# Altium schematic sheet LTC6803-3.SchDoc
size A4
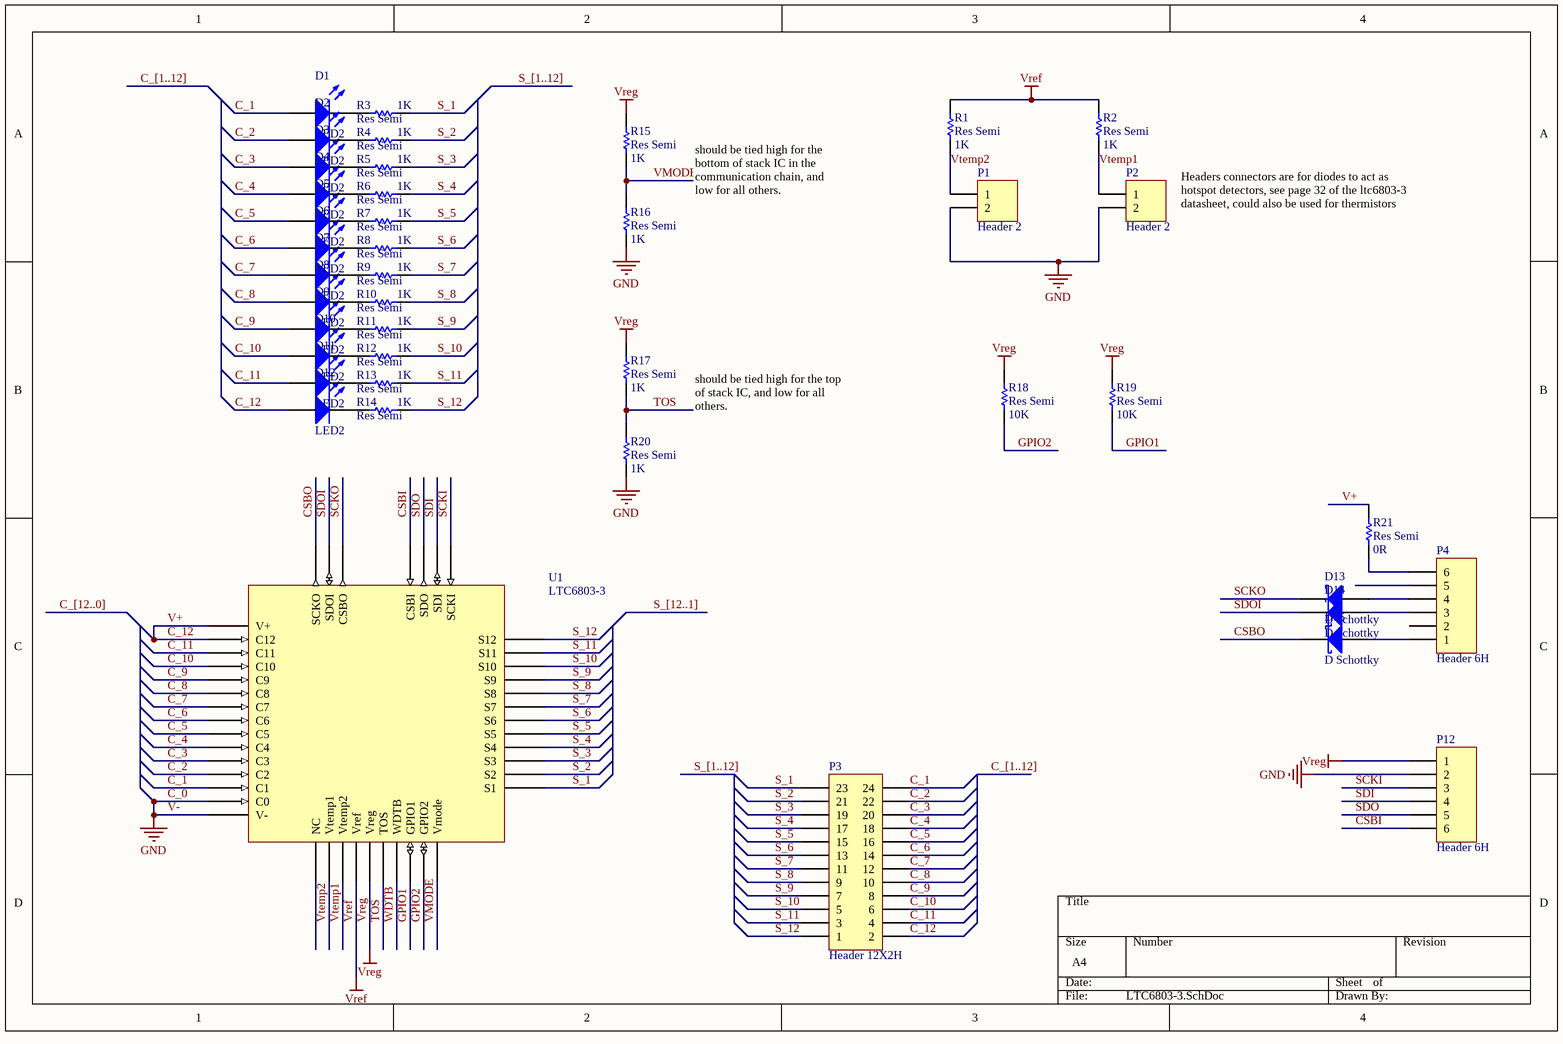
[diagram p0: LTC6803-3.SchDoc]

## Parts
D1  LED2  [6-0805_N]
D2  LED2  [6-0805_N]
D3  LED2  [6-0805_N]
D4  LED2  [6-0805_N]
D5  LED2  [6-0805_N]
D6  LED2  [6-0805_N]
D7  LED2  [6-0805_N]
D8  LED2  [6-0805_N]
D9  LED2  [6-0805_N]
D10  LED2  [6-0805_N]
D11  LED2  [6-0805_N]
D12  LED2  [6-0805_N]
D13  D Schottky  [SMB]
D14  D Schottky  [SMB]
D15  D Schottky  [SMB]
P1  Header 2  [HDR1X2]
P2  Header 2  [HDR1X2]
P3  Header 12X2H  [HDR2X12H]
P4  Header 6H  [HDR1X6H]
P12  Header 6H  [HDR1X6H]
R1  Res Semi  value 1K  [6-0805_L]
R2  Res Semi  value 1K  [6-0805_L]
R3  Res Semi  value 1K  [6-0805_L]
R4  Res Semi  value 1K  [6-0805_L]
R5  Res Semi  value 1K  [6-0805_L]
R6  Res Semi  value 1K  [6-0805_L]
R7  Res Semi  value 1K  [6-0805_L]
R8  Res Semi  value 1K  [6-0805_L]
R9  Res Semi  value 1K  [6-0805_L]
R10  Res Semi  value 1K  [6-0805_L]
R11  Res Semi  value 1K  [6-0805_L]
R12  Res Semi  value 1K  [6-0805_L]
R13  Res Semi  value 1K  [6-0805_L]
R14  Res Semi  value 1K  [6-0805_L]
R15  Res Semi  value 1K  [6-0805_L]
R16  Res Semi  value 1K  [6-0805_L]
R17  Res Semi  value 1K  [6-0805_L]
R18  Res Semi  value 10K  [6-0805_L]
R19  Res Semi  value 10K  [6-0805_L]
R20  Res Semi  value 1K  [6-0805_L]
R21  Res Semi  value 0R  [6-0805_L]
U1  LTC6803-3  [SOP44]

## Nets
C_0: P1.2 P2.2 P12.2 R16.1 R20.1 U1.29(C0) U1.30(V-)  [also labelled GND, V-]
Vref: R1.2 R2.2 U1.34(Vref)
Vreg: P12.1 R15.2 R17.2 R18.2 R19.2 U1.35(Vreg)
C_1: D1.1(A) P3.24 U1.27(C1)
C_2: D2.1(A) P3.22 U1.25(C2)
C_3: D3.1(A) P3.20 U1.23(C3)
C_4: D4.1(A) P3.18 U1.21(C4)
C_5: D5.1(A) P3.16 U1.19(C5)
C_6: D6.1(A) P3.14 U1.17(C6)
C_7: D7.1(A) P3.12 U1.15(C7)
C_8: D8.1(A) P3.10 U1.13(C8)
C_9: D9.1(A) P3.8 U1.11(C9)
C_10: D10.1(A) P3.6 U1.9(C10)
C_11: D11.1(A) P3.4 U1.7(C11)
C_12: D12.1(A) P3.2 R21.2 U1.4(V+) U1.5(C12)  [also labelled V+]
CSBI: P12.6 U1.44(CSBI)
CSBO: D15.2(K) U1.3(SCKO)
GPIO1: R19.1 U1.38(GPIO1)
GPIO2: R18.1 U1.39(GPIO2)
S_1: P3.23 R3.2 U1.28(S1)
S_2: P3.21 R4.2 U1.26(S2)
S_3: P3.19 R5.2 U1.24(S3)
S_4: P3.17 R6.2 U1.22(S4)
S_5: P3.15 R7.2 U1.20(S5)
S_6: P3.13 R8.2 U1.18(S6)
S_7: P3.11 R9.2 U1.16(S7)
S_8: P3.9 R10.2 U1.14(S8)
S_9: P3.7 R11.2 U1.12(S9)
S_10: P3.5 R12.2 U1.10(S10)
S_11: P3.3 R13.2 U1.8(S11)
S_12: P3.1 R14.2 U1.6(S12)
SCKI: P12.3 U1.41(SCKI)
SCKO: D13.2(K) U1.1(CSBO)
SDI: P12.4 U1.42(SDI)
SDO: P12.5 U1.43(SDO)
SDOI: D14.2(K) U1.2(SDOI)
TOS: R17.1 R20.2 U1.36(TOS)
VMODE: R15.1 R16.2 U1.40(Vmode)
Vtemp1: P2.1 R2.1 U1.33(Vtemp2)
Vtemp2: P1.1 R1.1 U1.32(Vtemp1)
WDTB: U1.37(WDTB)
NetD1_2: D1.2(K) R3.1
NetD2_2: D2.2(K) R4.1
NetD3_2: D3.2(K) R5.1
NetD4_2: D4.2(K) R6.1
NetD5_2: D5.2(K) R7.1
NetD6_2: D6.2(K) R8.1
NetD7_2: D7.2(K) R9.1
NetD8_2: D8.2(K) R10.1
NetD9_2: D9.2(K) R11.1
NetD10_2: D10.2(K) R12.1
NetD11_2: D11.2(K) R13.1
NetD12_2: D12.2(K) R14.1
NetD13_1: D13.1(A) P4.4
NetD14_1: D14.1(A) P4.3
NetD15_1: D15.1(A) P4.1
NetP4_6: P4.6 R21.1

Not connected (* = marked no-connect by the designer): P4 2 5; U1 31(NC)

## Buses and harness runs
bus C_[1..12]
bus C_[12..0]
bus S_[1..12]
bus S_[12..1]

## Notes on the sheet
- should be tied high for the bottom of stack IC in the communication chain, and low for all others.
- Headers connectors are for diodes to act as hotspot detectors, see page 32 of the ltc6803-3 datasheet, could also be used for thermistors
- should be tied high for the top of stack IC, and low for all others.

## Library data of the parts
D1-D12 = LED2: Typical RED, GREEN, YELLOW, AMBER GaAs LED; Published: 8-Jun-2000; LatestRevisionDate: 17-Jul-2002; LatestRevisionNote: Re-released for DXP Platform.; PackageVersion: Feb-2002; PackageReference: 3.2X1.6X1.1; Publisher: Altium Limited; PackageDescription: SM LED; 2 Flat Leads
D13-D15 = D Schottky: Schottky Diode; Published: 8-Jun-2000; LatestRevisionDate: 17-Jul-2002; LatestRevisionNote: Re-released for DXP Platform.; PackageReference: SMB; Publisher: Altium Limited; PackageDescription: DO-214-AA/SMB; 2 C-Bend Leads; Body 5.3 x 3.6 mm, inc. leads (LxW); Code_JEDEC: DO-214-AA
P1 P2 = Header 2: Header, 2-Pin; LatestRevisionDate: 17-Jul-2002; LatestRevisionNote: Re-released for DXP Platform.; Publisher: Altium Limited
P3 = Header 12X2H: Header, 12-Pin, Dual row, Right Angle; LatestRevisionDate: 17-Jul-2002; LatestRevisionNote: Re-released for DXP Platform.; Publisher: Altium Limited
P4 P12 = Header 6H: Header, 6-Pin, Right Angle; LatestRevisionDate: 17-Jul-2002; LatestRevisionNote: Re-released for DXP Platform.; Publisher: Altium Limited
R1-R21 = Res Semi: Semiconductor Resistor; Published: 8-Jun-2000; LatestRevisionDate: 17-Jul-2002; LatestRevisionNote: Re-released for DXP Platform.; PackageReference: AXIAL-0.5; Publisher: Altium Limited; PackageDescription: Axial Device, Thru-Hole; 2 Leads; 0.5 in Pin Spacing